# Altium schematic sheet XC7A35TFTG256_bank14.SchDoc
size A4; DocumentNumber: 16; SheetNumber: 16; SheetTotal: 21; SheetName: FPGA Bank 14
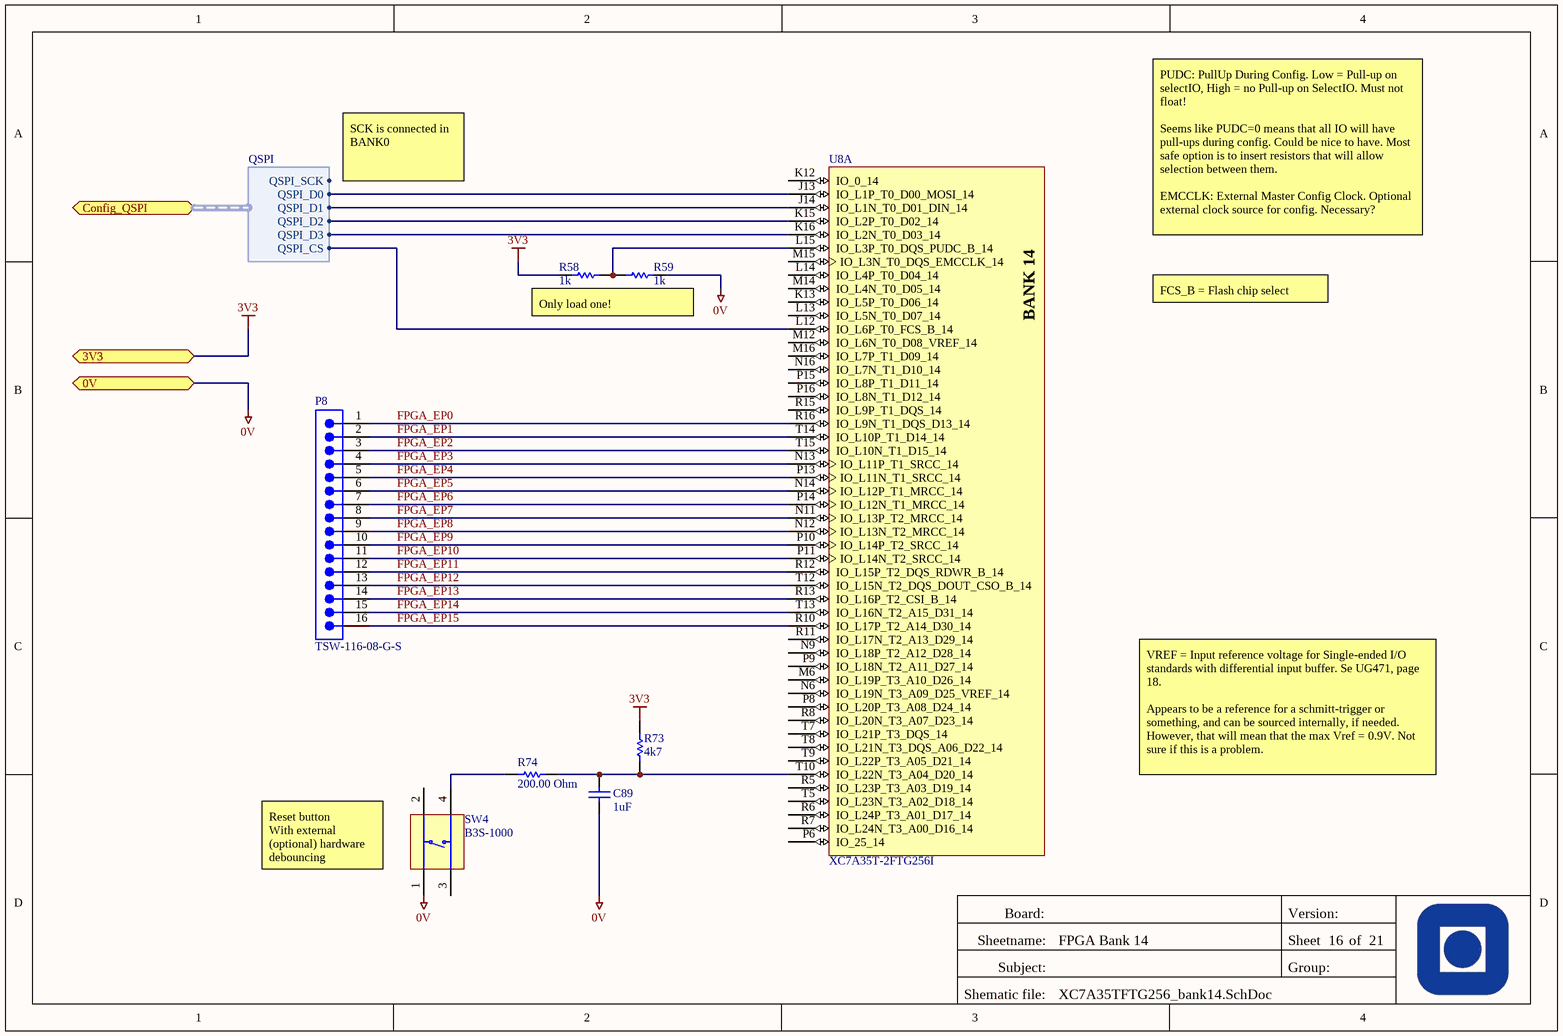
[diagram p0: XC7A35TFTG256_bank14.SchDoc]

## Parts
C89  value 1uF  [CAPC0603(1608)100_N]  (hidden comment: CAP 1uF 16V 0603(1608))
P8  TSW-116-08-G-S  [SMTC-TSW-116-08-X-S]
R58  value 1k  [RESC0603(1608)_L]  (hidden comment: 1K 5% 0603(1608))
R59  value 1k  [RESC0603(1608)_L]  (hidden comment: 1K 5% 0603(1608))
R73  value 4k7  [RESC0603(1608)_N]  (hidden comment: 4K7 1% 0603(1608))
R74  value 200.00 Ohm  [RESC0603(1608)_L]  (hidden comment: 200R 5% 0603(1608))
SW4  B3S-1000  [OMRON-B3S-1000-4_V]
U8  XC7A35T-2FTG256I  [FTG256]  (part A of 8)

## Ports
0V, 3V3, Config_QSPI (harness QSPI)

## Harnesses
QSPI: QSPI_D0, QSPI_D1, QSPI_D2, QSPI_D3, QSPI_SCK, QSPI_CS

## Nets
0V: C89.1 R59.2 SW4.1 ; port 0V
3V3: R58.1 R73.2 ; port 3V3
FPGA_EP0: P8.1 U8.R16(IO_L9N_T1_DQS_D13_14)
FPGA_EP1: P8.2 U8.T14(IO_L10P_T1_D14_14)
FPGA_EP2: P8.3 U8.T15(IO_L10N_T1_D15_14)
FPGA_EP3: P8.4 U8.N13(IO_L11P_T1_SRCC_14)
FPGA_EP4: P8.5 U8.P13(IO_L11N_T1_SRCC_14)
FPGA_EP5: P8.6 U8.N14(IO_L12P_T1_MRCC_14)
FPGA_EP6: P8.7 U8.P14(IO_L12N_T1_MRCC_14)
FPGA_EP7: P8.8 U8.N11(IO_L13P_T2_MRCC_14)
FPGA_EP8: P8.9 U8.N12(IO_L13N_T2_MRCC_14)
FPGA_EP9: P8.10 U8.P10(IO_L14P_T2_SRCC_14)
FPGA_EP10: P8.11 U8.P11(IO_L14N_T2_SRCC_14)
FPGA_EP11: P8.12 U8.R12(IO_L15P_T2_DQS_RDWR_B_14)
FPGA_EP12: P8.13 U8.T12(IO_L15N_T2_DQS_DOUT_CSO_B_14)
FPGA_EP13: P8.14 U8.R13(IO_L16P_T2_CSI_B_14)
FPGA_EP14: P8.15 U8.T13(IO_L16N_T2_A15_D31_14)
FPGA_EP15: P8.16 U8.R10(IO_L17P_T2_A14_D30_14)
NetC89_2: C89.2 R73.1 R74.2 U8.T10(IO_L22N_T3_A04_D20_14)
NetR58_2: R58.2 R59.1 U8.L15(IO_L3P_T0_DQS_PUDC_B_14)
NetR74_1: R74.1 SW4.4
NetU8_J13: U8.J13(IO_L1P_T0_D00_MOSI_14) ; port Config_QSPI.QSPI_D0
NetU8_J14: U8.J14(IO_L1N_T0_D01_DIN_14) ; port Config_QSPI.QSPI_D1
NetU8_K15: U8.K15(IO_L2P_T0_D02_14) ; port Config_QSPI.QSPI_D2
NetU8_K16: U8.K16(IO_L2N_T0_D03_14) ; port Config_QSPI.QSPI_D3
NetU8_L12: U8.L12(IO_L6P_T0_FCS_B_14) ; port Config_QSPI.QSPI_CS

Not connected (* = marked no-connect by the designer): SW4 2 3; U8 K12(IO_0_14) K13(IO_L5P_T0_D06_14) L13(IO_L5N_T0_D07_14) L14(IO_L4P_T0_D04_14) M6(IO_L19P_T3_A10_D26_14) M12(IO_L6N_T0_D08_VREF_14) M14(IO_L4N_T0_D05_14) M15(IO_L3N_T0_DQS_EMCCLK_14) M16(IO_L7P_T1_D09_14) N6(IO_L19N_T3_A09_D25_VREF_14) N9(IO_L18P_T2_A12_D28_14) N16(IO_L7N_T1_D10_14) P6(IO_25_14) P8(IO_L20P_T3_A08_D24_14) P9(IO_L18N_T2_A11_D27_14) P15(IO_L8P_T1_D11_14) P16(IO_L8N_T1_D12_14) R5(IO_L23P_T3_A03_D19_14) R6(IO_L24P_T3_A01_D17_14) R7(IO_L24N_T3_A00_D16_14) R8(IO_L20N_T3_A07_D23_14) R11(IO_L17N_T2_A13_D29_14) R15(IO_L9P_T1_DQS_14) T5(IO_L23N_T3_A02_D18_14) T7(IO_L21P_T3_DQS_14) T8(IO_L21N_T3_DQS_A06_D22_14) T9(IO_L22P_T3_A05_D21_14)

## Notes on the sheet
- SCK is connected in BANK0
- PUDC: PullUp During Config. Low = Pull-up on selectIO, High = no Pull-up on SelectIO. Must not float!
  Seems like PUDC=0 means that all IO will have pull-ups during config. Could be nice to have. Most safe option is to insert resistors that will allow selection between them.
  EMCCLK: External Master Config Clock. Optional external clock source for config. Necessary?
- Only load one!
- FCS_B = Flash chip select
- VREF = Input reference voltage for Single-ended I/O standards with differential input buffer. Se UG471, page 18.
  Appears to be a reference for a schmitt-trigger or something, and can be sourced internally, if needed. However, that will mean that the max Vref = 0.9V. Not sure if this is a problem.
- (near SW4) Reset button
  With external (optional) hardware debouncing
- Board:
- Version:
- Sheetname:
- Subject:
- Group:
- Sheet
- of
- Shematic file:
- (in symbol CMP-0383-00025-1, part A) BANK 14

## Library data of the parts
C89 = CMP-1035-02736-1: CAP 1uF 16V ±5% 0603 (1608 Metric) Thickness 1mm SMD; Case-Metric: 1608; Case-EIA: 0603; Tolerance: Â±5%; Technology: SMT; Max Thickness: 1 mm; Rated Voltage: 16 V
P8 = CMP-1024-00437-1: 0.025" SQ Post Header, Through-hole, Vertical, -55 to 125 degC, 2.54 mm Pitch, 16-Pin, Male, RoHS; Manufacturer: Samtec; Pitch: 2.54 mm; ComponentLink1Description: Manufacturer URL; PackageDescription: .025[0.64] SQ. Post Terminal Strip Assembly; PackageReference: TSW-116-08-X-S; PartNumber: TSW-116-08-G-S; ComponentLink2Description: Datasheet; ComponentLink1URL: http://www.samtec.com; Temperature Range: -55 to 125 degC; RoHS: True; PackageVersion: DM, 8/1988; ComponentLink3URL: http://www.samtec.com/documents/webfiles/cpdf/TSW-XXX-XX-XXX-X-XX-XXX-MKT.pdf; ComponentLink2URL: http://www.samtec.com/documents/webfiles/pdf/TSW_TH.PDF; Orientation: Vertical; ComponentLink3Description: Package Specification; Mounting Technology: Through-hole; DatasheetVersion: F-214
R58 R59 = CMP-1012-00074-1: 1K 0.1W 5% 0603 (1608 Metric)  SMD; Case-EIA: 0603; Case-Metric: 1608; Technology: SMT; Tolerance: 5 %; Power: 0.1 W
R73 = CMP-1012-00586-1: 4K7 0.1W 1% 0603 (1608 Metric)  SMD; Case-EIA: 0603; Case-Metric: 1608; Power: 0.1 W; Tolerance: 1 %; Technology: SMT
R74 = CMP-1012-00057-1: 200R 0.1W 5% 0603 (1608 Metric)  SMD; Case-EIA: 0603; Case-Metric: 1608; Technology: SMT; Tolerance: 5 %; Power: 0.1 W
SW4 = CMP-1677-00001-3: Sealed Tactile Switch, SPST-NO, 3 to 24 V, -25 to 70 degC, 4-Pin SMD, RoHS, Bulk; Current Rating: 50 mA; Voltage Rating: 24 V; Packaging: Bulk; PackageDescription: 4-Pin Surface Mount Device, Body 6.6 x 6 mm; Height: 4.3 mm; RoHSCompliant: true; REACH SVHC: No SVHC; Package Quantity: 1500; Mounting Technology: Surface Mount; Contact Plating: Silver; PackageReference: B3S-1000; Min Operating Temperature: -25 degC; DatasheetVersion: 10/2014; Mount: Surface Mount; Length: 6.6 mm; Max Operating Temperature: 70 degC
U8 = CMP-0383-00025-1: Artix-7 FPGA, 170 User I/Os, 0 GTP, 256-Ball BGA, Speed Grade 2, Industrial Grade, Pb-Free; Manufacturer: Xilinx; Logic Cells: 33280; GTP: 0; CMTs: 5; Available User I/O: 170; Total Block RAM: 1800 Kb; Speed Grades: 2; ComponentLink3Description: Pinout; ComponentLink4Description: Package Specification; ComponentLink2URL: http://www.xilinx.com/support/documentation/data_sheets/ds180_7Series_Overview.pdf; DatasheetVersion: Rev. 1.15; PackageVersion: Rev. 1.11; ComponentLink3URL: http://www.xilinx.com/support/documentation/user_guides/ug475_7Series_Pkg_Pinout.pdf; ComponentLink1Description: Manufacturer URL; PackageReference: FTG-256; ComponentLink1URL: http://www.xilinx.com/; ComponentLink4URL: http://www.xilinx.com/support/documentation/user_guides/ug475_7Series_Pkg_Pinout.pdf; Mounting Technology: Surface Mount; Maximum Distributed RAM: 400 Kb; PackageDescription: 256-Ball Wire-Bond Fine-Pitch Thin BGA, Body 17 x 17 mm, Pitch 1 mm; ComponentLink2Description: Datasheet; Operating Temperature Range: Industrial; PartNumber: XC7A35T-2FTG256I; PartId: 1